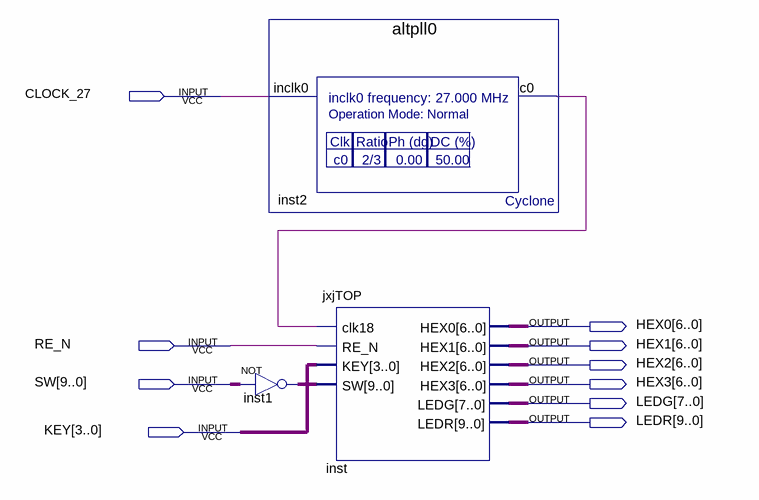
[diagram p0: schematic sheet]
// Quartus schematic JXJ_TOP.bdf as structural Verilog: 3 symbols, 10 pins
module JXJ_TOP (
  input  CLOCK_27,
  input  RE_N,
  input  [9:0] SW,
  input  [3:0] KEY,
  output [6:0] HEX0,
  output [6:0] HEX1,
  output [6:0] HEX2,
  output [6:0] HEX3,
  output [7:0] LEDG,
  output [9:0] LEDR
);

  wire inst2_c0;
  wire [9:0] inst1_out;

  altpll0 inst2 (.inclk0(CLOCK_27), .c0(inst2_c0));
  assign inst1_out = ~SW;  // NOT inst1, 10 bits wide
  jxjTOP inst (
    .clk18(inst2_c0), .RE_N(RE_N), .KEY(KEY), .SW(inst1_out), .HEX0(HEX0), .HEX1(HEX1), .HEX2(HEX2),
    .HEX3(HEX3), .LEDG(LEDG), .LEDR(LEDR));
endmodule
